# EAGLE design Transmitter Board_REV_4 (EAGLE 5.07)
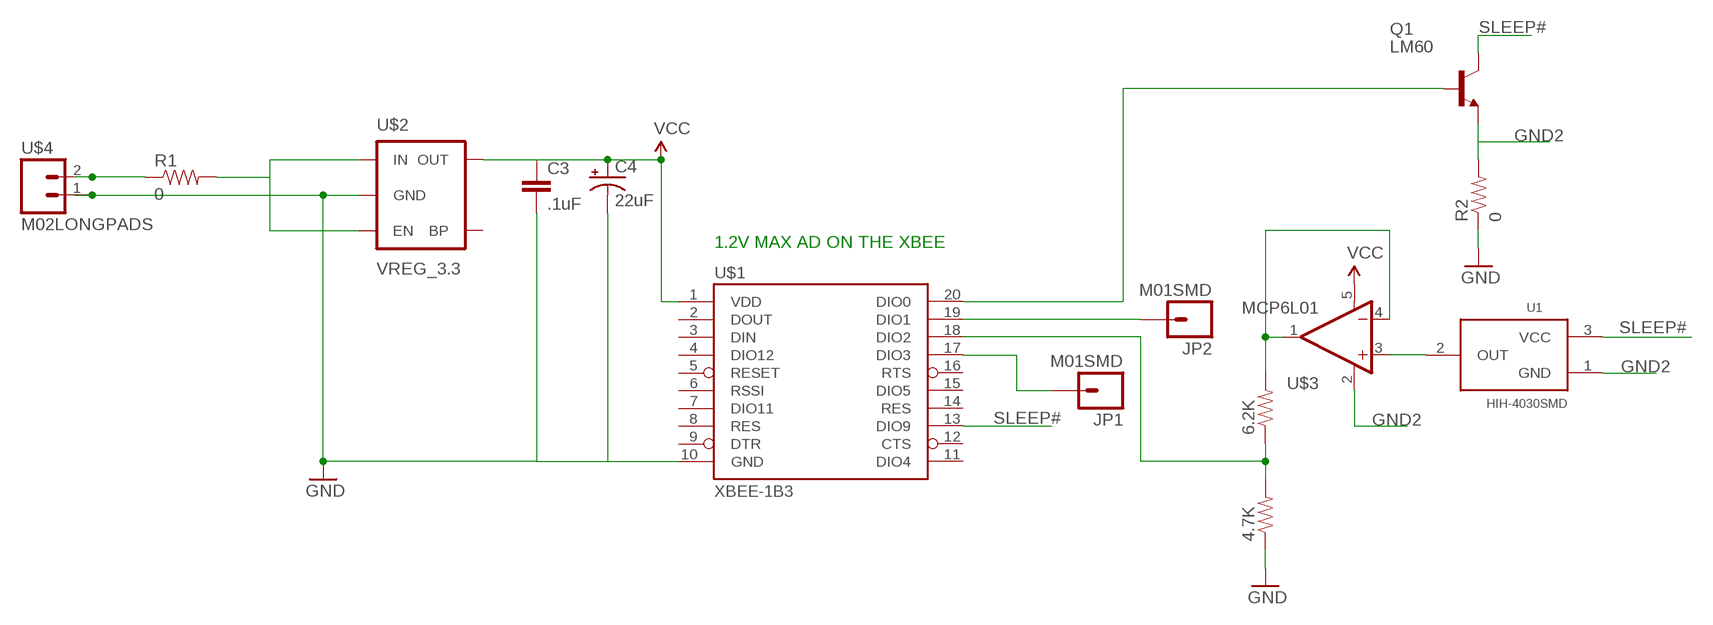
[diagram p0: schematic, sheet 1]

## Parts
4.7K  RESISTOR  [0805]
6.2K  RESISTOR  [0805]
C3  .1uF  CAP0805  [0805]
C4  22uF  CAP_POL1206  [EIA3216]
JP1  M01SMD  [LUXEON-PAD]
JP2  M01SMD  [LUXEON-PAD]
Q1  LM60  BC487  [TO92-EBC]
R1  0  RESISTOR1206  [1206]
R2  0  RESISTOR1206  [1206]
U1  HIH-4030SMD  [HIH-4030]
U$1  XBEE-1B3  [XBEE-SMD]
U$2  VREG_3.3  V_REG_LDOSMD  [SOT23-5]
U$3  MCP6L01  OPA344  [SOT23-5]
U$4  M02LONGPADS  [A19423-ELON]

## Nets
GND: 4.7K.1 C3.2 C4.C(-) R2.1 U$1.10(GND) U$2.2(GND) U$4.1
GND2: Q1.E R2.2 U1.1(GND) U$3.2(V-)
N$1: R1.2 U$2.1(IN) U$2.3(EN)
N$2: JP2.P$1 U$1.19(DIO1)
N$3: R1.1 U$4.2
N$4: JP1.P$1 U$1.17(DIO3)
N$5: Q1.B U$1.20(DIO0)
N$7: 6.2K.2 U$3.1(OUT) U$3.4(-IN)
N$8: 4.7K.2 6.2K.1 U$1.18(DIO2)
N$9: U1.2(OUT) U$3.3(+IN)
SLEEP#: Q1.C U1.3(VCC) U$1.13(DIO9)
VCC: C3.1 C4.A(+) U$1.1(VDD) U$2.5(OUT) U$3.5(V+)
Unconnected: U$1.2(DOUT) U$1.3(DIN) U$1.4(DIO12) U$1.5(RESET) U$1.6(RSSI) U$1.7(DIO11) U$1.8(RES) U$1.9(DTR) U$1.11(DIO4) U$1.12(CTS) U$1.14(RES) U$1.15(DIO5) U$1.16(RTS) U$2.4(BP)

## Notes on the sheet
- 1.2V MAX AD ON THE XBEE

## Library data of the parts
4.7K 6.2K R1 R2 = SparkFun:RESISTOR: Resistor Basic schematic elements and footprints for 0603, 1206, and PTH 1/10th watt (small) resistors.
C3 = SparkFun:CAP: Capacitor Standard 0603 ceramic capacitor, and 0.1" leaded capacitor.
C4 = SparkFun:CAP_POL: Capacitor Polarized These are standard SMD and PTH capacitors. Normally 10uF, 47uF, and 100uF in electrolytic and tantalum varieties. Always verify the external diameter of the through hole cap, it varies with capacity, voltage, and manufacturer. The EIA devices should be standard.
JP1 JP2 = SparkFun:M01: Header 1 Standard 1-pin 0.1" header. Use with straight break away headers (SKU : PRT-00116), right angle break away headers (PRT-00553), swiss pins (PRT-00743), machine pins (PRT-00117), and female headers (PRT-00115).
Q1 = transistor-npn:BC487*: NPN Transistor
U1 = SparkFun:HIH-4030: Humidity Sensor
U$1 = SparkFun:XBEE-1
U$2 = SparkFun:V_REG_LDO: Voltage Regulator LDO Standard 150mA LDO voltage regulator in SOT-23 layout. Micrel part MIC5205. BP (by-pass) pin is used to lower output noise with 470pF cap.
U$3 = SparkFun:OPA344
U$4 = _Part Repository:M02: 2-Position Headers

## Board
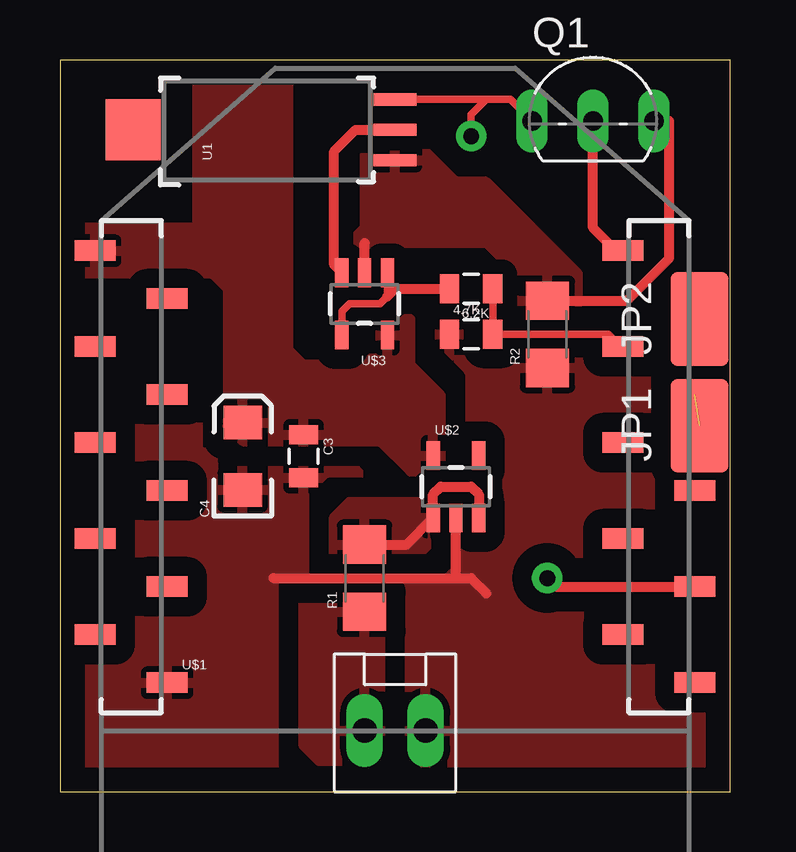
[diagram p1: board, top side]
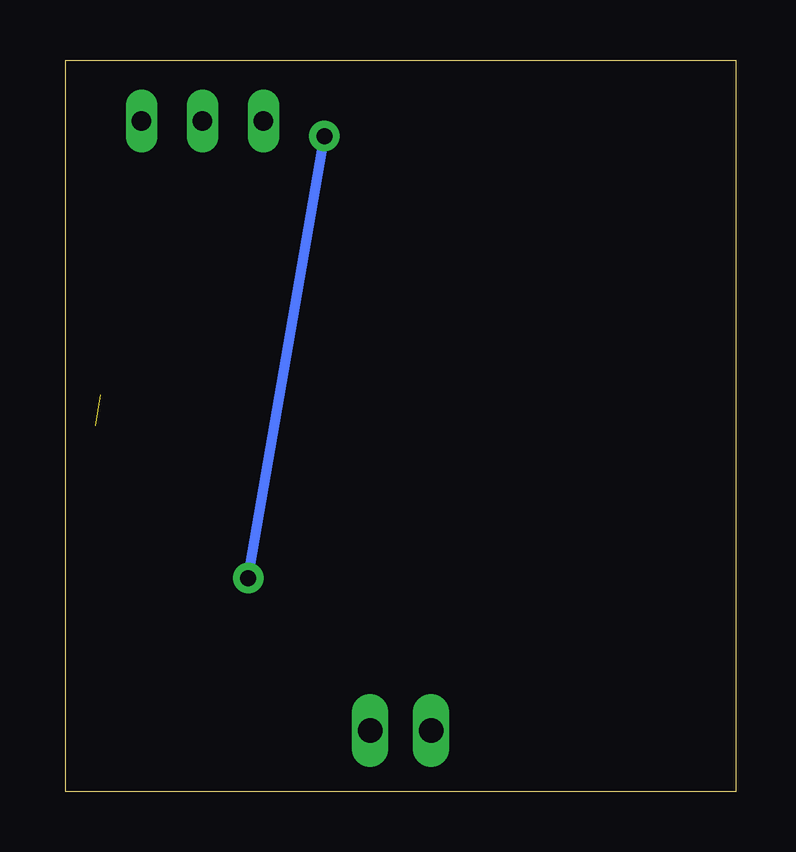
[diagram p2: board, bottom side, seen from below]

Size 27.94 x 30.48 mm. Coordinates in mm from the lower left corner, seen from the top.
Outline: 0,0 27.94,0 27.94,30.48 0,30.48 0,0
Copper layers (1*16): Top 0.035mm / dielectric 1.5mm / Bottom 0.035mm
Design rules "default": minimum track width 10mil, minimum drill 24mil, track to track 8mil, track to pad 8mil, pad to pad 8mil, via to via 8mil, smd to smd 8mil, copper to edge 40mil, drill to drill 8mil, minimum pad ring 10mil, minimum via ring 8mil, stop-mask expansion 4mil, vias tented up to drill 0mil, thermal gap 10mil

### Footprints (pad centres in the part's own frame; a part is rotated, then mirrored left to right if it is on the bottom)
0805 = smd 0.8 x 1.2: 1 -0.9,0; 2 0.9,0
EIA3216 = smd 1.4 x 1.6: A 1.4,0; C -1.4,0
LUXEON-PAD = smd 3.9 x 2.4: P$1 0,0
TO92-EBC = drill 0.813 long: B 0,-1.27; C -2.54,-1.27; E 2.54,-1.27
1206 = smd 1.6 x 1.8: 1 -1.4,0; 2 1.4,0
HIH-4030 = smd 0.508 x 1.778: 1 -1.27,-5.08; 2 0,-5.08; 3 1.27,-5.08 | smd 2.54 x 2.286: NC 0,5.842
XBEE-SMD = smd 1.7 x 0.85: 1 -12.5,20; 2 -9.5,18; 3 -12.5,16; 4 -9.5,14; 5 -12.5,12; 6 -9.5,10; 7 -12.5,8; 8 -9.5,6; 9 -12.5,4; 10 -9.5,2; 11 12.5,2; 12 9.5,4; 13 12.5,6; 14 9.5,8; 15 12.5,10; 16 9.5,12; 17 12.5,14; 18 9.5,16; 19 12.5,18; 20 9.5,20
SOT23-5 = smd 0.55 x 1.2: 1 -0.95,-1.3; 2 0,-1.3; 3 0.95,-1.3; 4 0.95,1.3; 5 -0.95,1.3
A19423-ELON = drill 1.02 long: 1 1.27,0; 2 -1.27,0

### Placement (x,y rotation side)
4.7K  17.14,19.05 0 top
6.2K  17.14,20.95 180 top
C3  10.16,13.97 270 top
C4  7.62,13.97 90 top
JP1  26.67,15.24 90 top
JP2  26.67,19.68 90 top
Q1  22.23,29.21 0 top
R1  12.7,8.89 90 top
R2  20.32,19.05 90 top
U1  8.89,27.57 90 top
U$1  13.97,2.54 0 top
U$2  16.51,12.7 0 top
U$3  12.7,20.32 180 top
U$4  13.97,2.54 0 top

### Tracks (layer width: path | path; a pad name or v marks a point on that pad's centre or on a via)
GND
  Top 0.406: 16.51,8.89 U$2.2 | 8.89,8.89 17.14,8.89 17.78,8.26
  pour Top (isolate 0.813, rank 2): 3.17,3.81 3.17,5.08 5.08,5.08 6.35,6.35 6.35,12.7 6.99,13.34 11.43,13.34 11.43,10.16 10.79,9.53 9.53,9.53 9.53,3.81 8.89,3.17 3.81,3.17
  pour Top (isolate 0.813, rank 2): 14.61,1.91 14.61,5.71 15.88,6.99 15.88,8.26 16.51,8.89 18.41,8.89 19.05,9.53 19.05,15.88 18.41,16.51 13.34,16.51 10.79,19.05 11.43,19.68 12.06,19.68 13.97,17.78 20.95,17.78 21.59,17.14 21.59,8.26 19.68,6.35 19.68,5.08 16.51,1.91
  pour Top (isolate 0.813, rank 3): 0,0 0,30.48 27.94,30.48 27.94,0
GND2
  Top 0.305: 19.82,20.45 R2.2
  Top 0.406: R2.2 23.62,20.45 25.4,22.23 25.4,27.94 Q1.E | U$3.2 12.7,22.86
  pour Top (isolate 0.61): 12.7,26.67 12.7,23.5 12.06,22.86 12.06,21.59 12.7,20.95 13.34,21.59 13.34,22.23 13.97,22.86 17.78,22.86 19.05,21.59 19.05,20.32 19.68,19.68 20.95,19.68 21.59,20.32 21.59,21.59 17.78,25.4 16.51,25.4 15.24,26.67
N$1
  Top 0.406: U$2.3 17.46,12.38 17.14,12.7 15.88,12.7 15.56,12.38 U$2.1 14.45,10.29 R1.2
  pour Top (isolate 0.813): 11.43,9.53 11.43,11.43 12.06,12.06 15.88,12.06 15.88,10.79 14.61,9.53
N$2
  Top 0.406: U$1.19 26.67,20.54 JP2.P$1
N$3
  pour Top (isolate 0.813): 10.16,8.26 13.34,8.26 13.34,1.27 10.79,1.27 10.16,1.91
N$4  (1 unrouted)
N$5
  Top 0.406: U$1.20 23.18,22.54 22.23,23.5 Q1.B
N$7
  Top 0.305: U$3.4 11.75,20 12.06,20.32 13.34,20.32 13.65,20.64 U$3.1
  Top 0.406: 13.65,20.64 13.97,20.95 6.2K.2
N$8
  Top 0.305: U$1.18 23.37,18.54 22.86,19.05 4.7K.2 6.2K.1
N$9
  Top 0.406: U1.2 12.33,27.57 11.43,26.67 11.43,21.94 U$3.3
SLEEP#  (via drill 0.66 pad 1.27)
  Top 0.305: 17.78,28.84 U1.3 | 17.78,28.84 18.79,28.84 Q1.C | v17.14,27.3 17.14,28.2 17.78,28.84
  Top 0.406: U$1.13 20.67,8.54 v20.32,8.89
  Bottom 0.406: v20.32,8.89 v17.14,27.3
VCC
  pour Top (isolate 0.813): 15.88,13.34 15.88,16.51 14.61,17.78 14.61,19.68 13.34,19.68 13.34,18.41 12.7,17.78 10.16,17.78 9.53,18.41 9.53,29.84 5.71,29.84 5.71,23.5 0.64,23.5 0.64,21.59 6.35,21.59 6.99,20.95 6.99,15.24 7.62,14.61 13.34,14.61 14.61,13.34